# Altium project AdaptadorCarro.PrjPcb
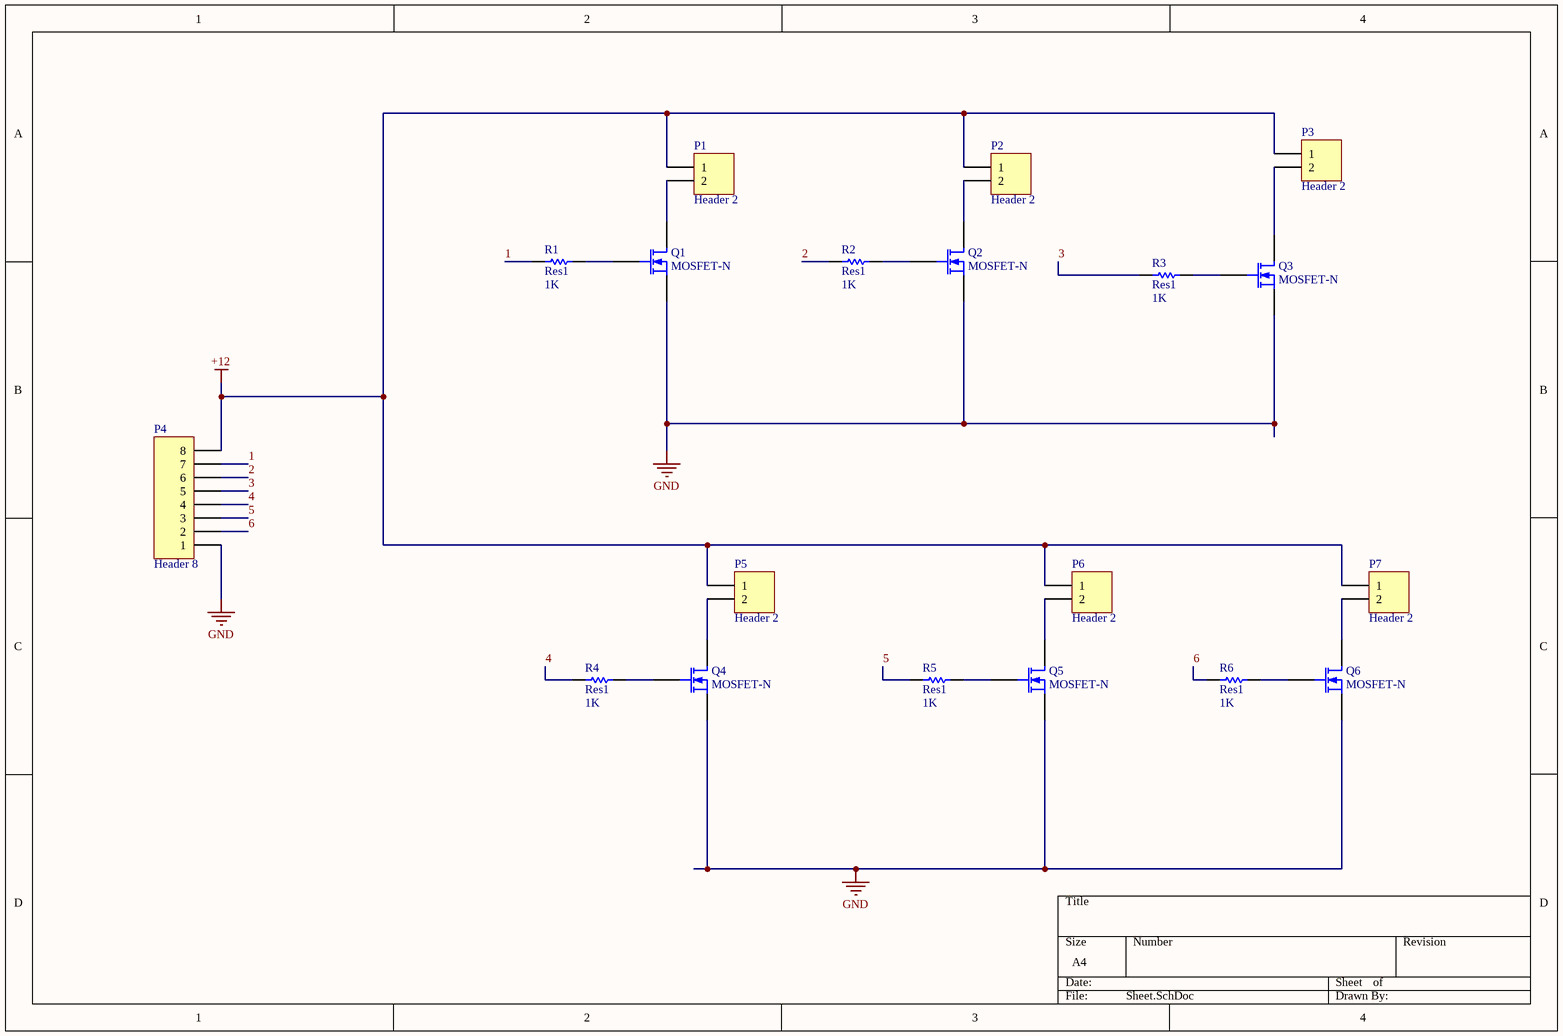
[diagram p0: Sheet.SchDoc]
1 sheet, 19 parts. Net scope: global (net labels, ports and power ports of the same name join across sheets).
Board file: PCB2.PcbDoc

## Sheet Sheet.SchDoc
size A4; SheetNumber: 1; SheetTotal: 1; SPICEModelCacheLVHJQNXB: <root> / <DocumentId>LVHJQNXB</DocumentId> / <CacheFrame Number="0"> / <Model Name="nmos" Kind="MDL"> / <Text>*Default N-Channel MOSFET / *Pinout: D,G,S / .MODEL NMOS NMOS()</Text> / </Model> / </CacheFrame> / </root>

### Parts
P1  Header 2  [HDR1X2]
P2  Header 2  [HDR1X2]
P3  Header 2  [HDR1X2]
P4  Header 8  [HDR1X8]
P5  Header 2  [HDR1X2]
P6  Header 2  [HDR1X2]
P7  Header 2  [HDR1X2]
Q1  MOSFET-N  [E3]
Q2  MOSFET-N  [E3]
Q3  MOSFET-N  [E3]
Q4  MOSFET-N  [E3]
Q5  MOSFET-N  [E3]
Q6  MOSFET-N  [E3]
R1  Res1  value 1K  [AXIAL-0.3]
R2  Res1  value 1K  [AXIAL-0.3]
R3  Res1  value 1K  [AXIAL-0.3]
R4  Res1  value 1K  [AXIAL-0.3]
R5  Res1  value 1K  [AXIAL-0.3]
R6  Res1  value 1K  [AXIAL-0.3]

### Nets
+12: P1.1 P2.1 P3.1 P4.8 P5.1 P6.1 P7.1
GND: P4.1 Q1.3(S) Q2.3(S) Q3.3(S) Q4.3(S) Q5.3(S) Q6.3(S)
1: P4.7 R1.1
2: P4.6 R2.1
3: P4.5 R3.1
4: P4.4 R4.1
5: P4.3 R5.1
6: P4.2 R6.1
NetP1_2: P1.2 Q1.1(D)
NetP2_2: P2.2 Q2.1(D)
NetP3_2: P3.2 Q3.1(D)
NetP5_2: P5.2 Q4.1(D)
NetP6_2: P6.2 Q5.1(D)
NetP7_2: P7.2 Q6.1(D)
NetQ1_2: Q1.2(G) R1.2
NetQ2_2: Q2.2(G) R2.2
NetQ3_2: Q3.2(G) R3.2
NetQ4_2: Q4.2(G) R4.2
NetQ5_2: Q5.2(G) R5.2
NetQ6_2: Q6.2(G) R6.2

### Library data of the parts
P1-P3 P5-P7 = Header 2: Header, 2-Pin; LatestRevisionDate: 17-Jul-2002; LatestRevisionNote: Re-released for DXP Platform.; Publisher: Altium Limited
P4 = Header 8: Header, 8-Pin; LatestRevisionDate: 17-Jul-2002; LatestRevisionNote: Re-released for DXP Platform.; Publisher: Altium Limited
Q1-Q6 = MOSFET-N: N-Channel MOSFET; Published: 8-Jun-2000; LatestRevisionDate: 17-Jul-2002; LatestRevisionNote: Re-released for DXP Platform.; PackageVersion: 1995/1996; PackageReference: E3; Publisher: Altium Limited; PackageDescription: TO, Flat Index; 3 In-Line, Axial Leads; Body Dia. 4.6mm; Lead Dia. 0.5 mm (max)
R1-R6 = Res1: Resistor; Published: 8-Jun-2000; LatestRevisionDate: 17-Jul-2002; LatestRevisionNote: Re-released for DXP Platform.; PackageReference: AXIAL-0.3; Publisher: Altium Limited; PackageDescription: Axial Device, Thru-Hole; 2 Leads; 0.3 in Pin Spacing